# EasyEDA Pro project ProPrj_队内赛遥控器_2024-09-27.epro

# Schematic Schematic1
Board Name: Board1; Create Date: 2024-09-19
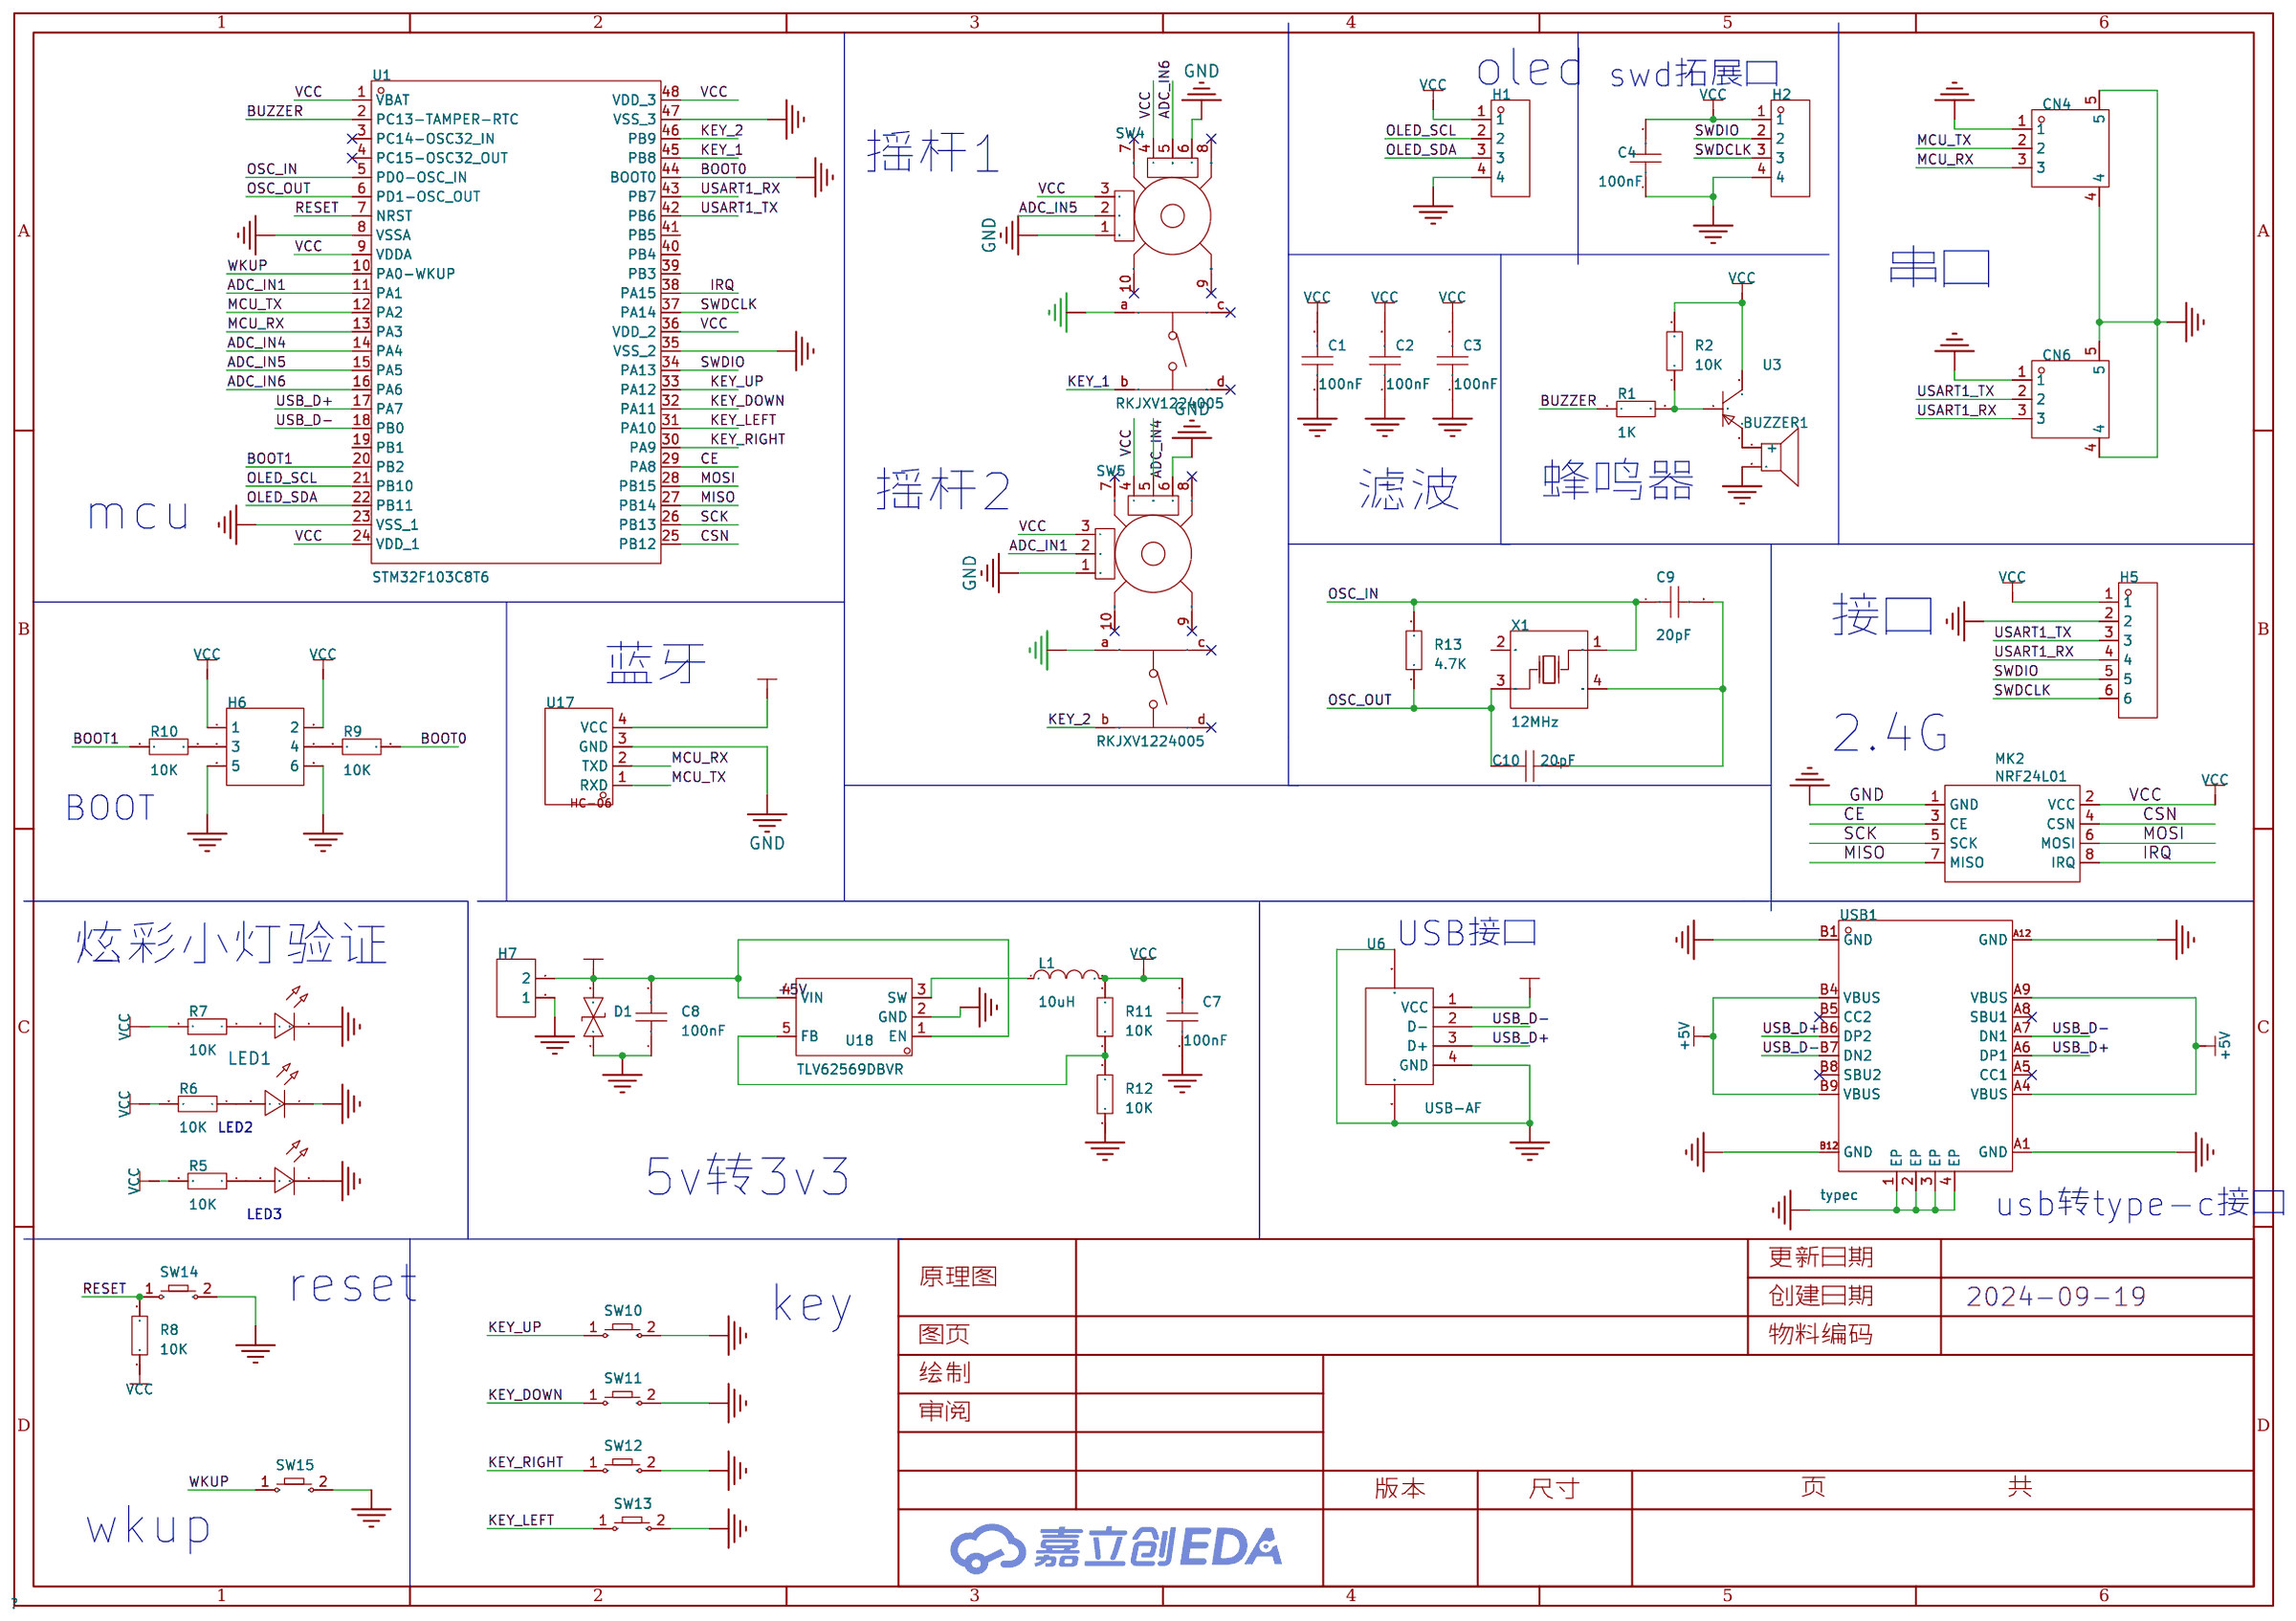
[diagram p0: schematic sheet]

## Parts
BUZZER1  buzzer-12X9  [BUZ-TH_BD12.0-P7.60-D0.6-FD]
C1  100nF  [C0603]
C2  100nF  [C0603]
C3  100nF  [C0603]
C4  100nF  [C0603]
C7  100nF  [C0603]
C8  100nF  [C0603]
C9  20pF  [C0603]
C10  20pF  [C0603]
CN4  A1257WV-S-3P  [CONN-SMD_A1257WV-S-3P]
CN6  A1257WV-S-3P  [CONN-SMD_A1257WV-S-3P]
D1  P6SMB6.8CA/TR13  [SMB_L4.6-W3.6-LS5.3-BI]
H1  -  [HDR-TH_4P-P2.54-V-F]
H2  -  [HDR-TH_4P-P2.54-V-F]
H5  -  [HDR-TH_6P-P2.54-V-F]
H6  -  [HDR-TH_6P-P2.54-V-F-R2-C3-S2.54]
H7  -  [HDR-TH_2P-P2.54-V-F]
L1  10uH  [L0603]
LED1  -  [LED_0603]
LED2  -  [LED_0603]
LED3  -  [LED_0603]
MK2  NRF24L01  [WIRELM-SMD_NRF24L01]
R1  1K  [R0603]
R2  10K  [R0603]
R5  10K  [R0603]
R6  10K  [R0603]
R7  10K  [R0603]
R8  10K  [R0603]
R9  10K  [R0603]
R10  10K  [R0603]
R11  10K  [R0603]
R12  10K  [R0603]
R13  4.7K  [R0603]
SW4  RKJXV1224005  [SW-TH_RKJXV1224005]
SW5  RKJXV1224005  [SW-TH_RKJXV1224005]
SW10  -  [Key_SMD_3x4x2]
SW11  -  [Key_SMD_3x4x2]
SW12  -  [Key_SMD_3x4x2]
SW13  -  [Key_SMD_3x4x2]
SW14  -  [Key_SMD_3x4x2]
SW15  -  [Key_SMD_3x4x2]
U1  STM32F103C8T6  [LQFP-48_L7.0-W7.0-P0.50-LS9.0-BL]
U3  S9012  [SOT-23-3_L2.9-W1.3-P0.95-LS2.4-BR]
U6  USB-AF  [USB-A-TH_USB-302-T]
U17  -  [HC-06]
U18  TLV62569DBVR  [SOT-23-5_L3.0-W1.7-P0.95-LS2.8-BR]
USB1  typec  [USB-C-SMD_KH-TYPE-C-16P]
X1  12MHz  [OSC-SMD_4P-L3.2-W2.5-BL]

## Library data of the parts
BUZZER1 = buzzer-12X9: Supplier Part: C9900016920; Supplier Footprint: BUZZER_SMT_9650B; JLCPCB Part Class: 扩展库; Supplier: LCSC
C1-C4 C7-C10 = CAP_0603: Supplier Footprint: 0603
CN4 CN6 = A1257WV-S-3P: 插针结构:1x3P;间距:1.25mm;安装方式:-;参考系列:GH;总PIN数:3P;排数:1;每排PIN数:3;行距:-;触头材质:黄铜;; LCSC Part Name: 系列:GH 间距:1.25mm 1x3P; Supplier Part: C225119; Manufacturer: CJT(长江连接器); Supplier Footprint: SMD,P=1.25mm; JLCPCB Part Class: 扩展库; Datasheet: https://atta.szlcsc.com/upload/public/pdf/source/20181008/C272994_C9E89FA8A36D0009CAD30AD8C59C2782.pdf; Supplier: LCSC; Pins Structure: 1x3P; Pitch: 1.25mm; Reference Series: GH; Number of Pins: 3P; Number of Rows: 1; Number of PINs Per Row: 3; Contact Material: 黄铜
D1 = P6SMB6.8CA/TR13: 反向截止电压(Vrwm):5.8V;最大钳位电压:10.5V;峰值脉冲电流(Ipp)@10/1000us:58.1A;峰值脉冲功率(Ppp)@10/1000us:600W;击穿电压:6.45V;; Supplier Part: C78395; Manufacturer: Brightking(君耀电子); Supplier Footprint: SMB(DO-214AA); JLCPCB Part Class: 基础库; Datasheet: https://atta.szlcsc.com/upload/public/pdf/source/20160709/1468031879762.pdf; Supplier: LCSC; Reverse Stand-Off Voltage (Vrwm): 5.8V; Maximum Clamping Voltage: 10.5V; Peak Pulse Current (Ipp)@10/1000us: 58.1A; Peak Pulse Power Dissipation (Ppp)@10/1000us: 600W; Breakdown Voltage: 6.45V; Type: TVS
H1 H2 = HDR-F_2.54_1x4P: Supplier Part: C2718488; Supplier Footprint: 插件
H5 = HDR-F_2.54_1x6P: Supplier Part: C40877; Supplier Footprint: 插件
H6 = HDR-F_2.54_2x3: Supplier Part: C92272; Supplier Footprint: 插件
H7 = HDR-F_2.54_1x2P: Supplier Part: C49661; Supplier Footprint: 插件
L1 = L_0603
LED1 = LED_0603-R: Supplier Footprint: 0603
LED2 = LED_0603-G: Supplier Footprint: 0603
LED3 = LED_0603-B: Supplier Footprint: 0603
MK2 = NRF24L01: Supplier: LCSC; Manufacturer: Ai-Thinker; Manufacturer Part: NRF24L01+功率加强版绑定2.4Gwireless module; Supplier Part: C90751
R1 R2 R5-R13 = Res_0603: Supplier Footprint: 0603
SW4 SW5 = RKJXV1224005: 操纵杆复位 中央按动开关 适用于航模玩具遥控器电位器、3D摇杆PS4手柄游戏机、无人机摇杆电位器、工业控制器; Supplier Part: C146170; Manufacturer: ALPSALPINE(阿尔卑斯阿尔派); Supplier Footprint: 13x13mm; JLCPCB Part Class: Extended Part; Datasheet: https://atta.szlcsc.com/upload/public/pdf/source/20180125/C146170_15168615510911301620.pdf; Supplier: LCSC
SW10-SW15 = Key_SMD_3x4x2: Supplier Footprint: SMD
U1 = STM32F103C8T6: CPU内核:ARM-M3;程序存储容量:64KB;RAM总容量:20KB;GPIO端口数量:37;工作电压范围:2V~3.6V;CPU最大主频:72MHz;程序存储器类型:FLASH;; LCSC Part Name: 主流增强型ARM Cortex-M3 MCU，具有64 KB Flash、72 MHz CPU、电机控制、USB和CAN; Supplier Part: C8734; Manufacturer: ST(意法半导体); Supplier Footprint: LQFP-48(7x7); JLCPCB Part Class: 扩展库; Datasheet: https://atta.szlcsc.com/upload/public/pdf/source/20220812/8363ACEC51AD55ECEB84799464F7CB85.pdf; Supplier: LCSC; CPU Core: ARM-M3; Program Storage Size: 64KB; RAM Size: 20KB; GPIO Ports Number: 37; Operating Voltage Range: 2V~3.6V; CPU Maximum Speed: 72MHz; Program Memory Type: FLASH; Operating Temperature Range: -40℃~+85℃; ADC (Bit): 12bit; Universal Serial Bus: 有; Peripheral/Function: 看门狗；DMA；看门狗；温度传感器; Watchdog: 有; Infrared Data Association: 有; Low-Voltage Detect: 有; Direct Memory Access: 有; Internal Oscillator: 有
U3 = S9012_C2914401: LCSC Part Name: 三极管; Supplier Part: C2914401; Manufacturer: MSKSEMI(美森科); Supplier Footprint: SOT-23; Datasheet: https://atta.szlcsc.com/upload/public/pdf/source/20231208/E0AD297AB2D8DB55F2C7FE99169BA696.pdf; Supplier: LCSC
U6 = USB-AF: Supplier Part: C9900021158; Supplier Footprint: USB-A; JLCPCB Part Class: 扩展库; Supplier: LCSC
U17 = HC-06: 蓝牙模块-4P; _: 3; Check: false
U18 = TLV62569DBVR: 功能类型:降压型;输出类型:可调;输入电压:2.5V~5.5V;输出电压:600mV~5.5V;输出电流(最大值):2A;; Supplier Part: C141836; Manufacturer: TI(德州仪器); Supplier Footprint: SOT-23-5; JLCPCB Part Class: 扩展库; Datasheet: https://www.ti.com/cn/lit/gpn/tlv62569; Supplier: LCSC; Function: 降压型; Output Type: 可调; Input Voltage: 2.5V~5.5V; Output Voltage: 600mV~5.5V; Output Current (Max): 2A; Switching Frequency: 1.5MHz; Operating Temperature: -40℃~+125℃@(TJ); Synchronous Rectification: 是; Topology: 降压式; Switch tube (built-in/external): 内置
USB1 = typec: Supplier Part: C9900016956; Supplier Footprint: typec 12p; JLCPCB Part Class: 扩展库; Supplier: LCSC
X1 = X322512MSB4SI: 晶振类型:贴片晶振;频率:12MHz;常温频差:±10ppm;外接负载电容:20pF;频率稳定度(全温):±20ppm;; LCSC Part Name: 12MHz ±10ppm 20pF; Supplier Part: C9002; Manufacturer: YXC(扬兴晶振); Supplier Footprint: SMD3225-4P; JLCPCB Part Class: 基础库; Datasheet: https://atta.szlcsc.com/upload/public/pdf/source/20240329/19D5F850207469550BEB00D7DFEDBC7A.pdf; Supplier: LCSC; Crystal Type: 贴片晶振; Normal temperature Frequency Tolerance: ±10ppm; External load capacitor: 20pF; Frequency Stability(Full temperature range): ±20ppm; Operating Temperature: -40℃~+85℃

## Nets
+5V: C8.2 D1.2 H7.2 U6.1(VCC) U18.1(EN) U18.4(VIN) USB1.A4(VBUS) USB1.A9(VBUS) USB1.B4(VBUS) USB1.B9(VBUS)
GND: BUZZER1.2 C1.1 C2.1 C3.1 C4.1 C7.1 C8.1 CN4.1 CN4.4 CN4.5 CN6.1 CN6.4 CN6.5 D1.1 H1.4 H2.4 H5.2 H6.5 H6.6 H7.1 LED1.1(C) LED2.1(C) LED3.1(C) MK2.1(GND) R12.1 SW4.1(B) SW4.6(B) SW4.a SW5.1(B) SW5.6(B) SW5.a SW10.2 SW11.2 SW12.2 SW13.2 SW14.2 SW15.2 U1.8(VSSA) U1.23(VSS_1) U1.35(VSS_2) U1.47(VSS_3) U6.4(GND) U6.5 U6.6 U17.3(GND) U18.2(GND) USB1.1(EP) USB1.2(EP) USB1.3(EP) USB1.4(EP) USB1.A1(GND) USB1.A12(GND) USB1.B1(GND) USB1.B12(GND)
VCC: C1.2 C2.2 C3.2 C4.2 C7.2 H1.1 H2.1 H5.1 H6.1 H6.2 L1.2 MK2.2(VCC) R2.2 R5.2 R6.2 R7.2 R8.1 R11.2 SW4.3(A) SW4.4(A) SW5.3(A) SW5.4(A) U1.1(VBAT) U1.9(VDDA) U1.24(VDD_1) U1.36(VDD_2) U1.48(VDD_3) U3.3(C) U17.4(VCC)
ADC_IN1: SW5.2(DTA) U1.11(PA1)
ADC_IN4: SW5.5(DTA) U1.14(PA4)
ADC_IN5: SW4.2(DTA) U1.15(PA5)
ADC_IN6: SW4.5(DTA) U1.16(PA6)
BOOT0: R9.2 U1.44(BOOT0)
BOOT1: R10.1 U1.20(PB2)
BUZZER: R1.1 U1.2(PC13-TAMPER-RTC)
CE: MK2.3(CE) U1.29(PA8)
CSN: MK2.4(CSN) U1.25(PB12)
IRQ: MK2.8(IRQ) U1.38(PA15)
KEY_1: SW4.b U1.45(PB8)
KEY_2: SW5.b U1.46(PB9)
KEY_DOWN: SW11.1 U1.32(PA11)
KEY_LEFT: SW13.1 U1.31(PA10)
KEY_RIGHT: SW12.1 U1.30(PA9)
KEY_UP: SW10.1 U1.33(PA12)
MCU_RX: CN4.3 U1.13(PA3) U17.2(TXD)
MCU_TX: CN4.2 U1.12(PA2) U17.1(RXD)
MISO: MK2.7(MISO) U1.27(PB14)
MOSI: MK2.6(MOSI) U1.28(PB15)
OLED_SCL: H1.2 U1.21(PB10)
OLED_SDA: H1.3 U1.22(PB11)
OSC_IN: C9.1 R13.2 U1.5(PD0-OSC_IN) X1.1(OSC1)
OSC_OUT: C10.1 R13.1 U1.6(PD1-OSC_OUT) X1.3(OSC2)
RESET: R8.2 SW14.1 U1.7(NRST)
SCK: MK2.5(SCK) U1.26(PB13)
SWDCLK: H2.3 H5.6 U1.37(PA14)
SWDIO: H2.2 H5.5 U1.34(PA13)
USART1_RX: CN6.3 H5.4 U1.43(PB7)
USART1_TX: CN6.2 H5.3 U1.42(PB6)
USB_D+: U1.17(PA7) U6.3(D+) USB1.A6(DP1) USB1.B6(DP2)
USB_D-: U1.18(PB0) U6.2(D-) USB1.A7(DN1) USB1.B7(DN2)
WKUP: SW15.1 U1.10(PA0-WKUP)
$1N1068: BUZZER1.1(+) U3.2(E)
$1N1070: R1.2 R2.1 U3.1(B)
$1N1843: LED3.2(A) R5.1
$1N1848: LED2.2(A) R6.1
$1N1853: LED1.2(A) R7.1
$1N7181: H6.4 R9.1
$1N7183: H6.3 R10.2
$1N9291: R11.1 R12.2 U18.5(FB)
$1N9393: L1.1 U18.3(SW)
$1N10654: C9.2 C10.2 X1.4(GND)

Not connected (* = marked no-connect by the designer): SW4 7(GND)* 8(GND)* 9(GND)* 10(GND)* c* d*; SW5 7(GND)* 8(GND)* 9(GND)* 10(GND)* c* d*; U1 3(PC14-OSC32_IN)* 4(PC15-OSC32_OUT)* 19(PB1) 39(PB3) 40(PB4) 41(PB5); USB1 A5(CC1)* A8(SBU1)* B5(CC2)* B8(SBU2)*; X1 2(GND)

## Notes on the sheet
- oled
- swd拓展口
- 摇杆1
- 串口
- 摇杆2
- 滤波
- 蜂鸣器
- mcu
- 接口
- 蓝牙
- 2.4G
- BOOT
- USB接口
- 炫彩小灯验证
- 5v转3v3
- usb转type-c接口
- reset
- key
- wkup

# Board PCB6
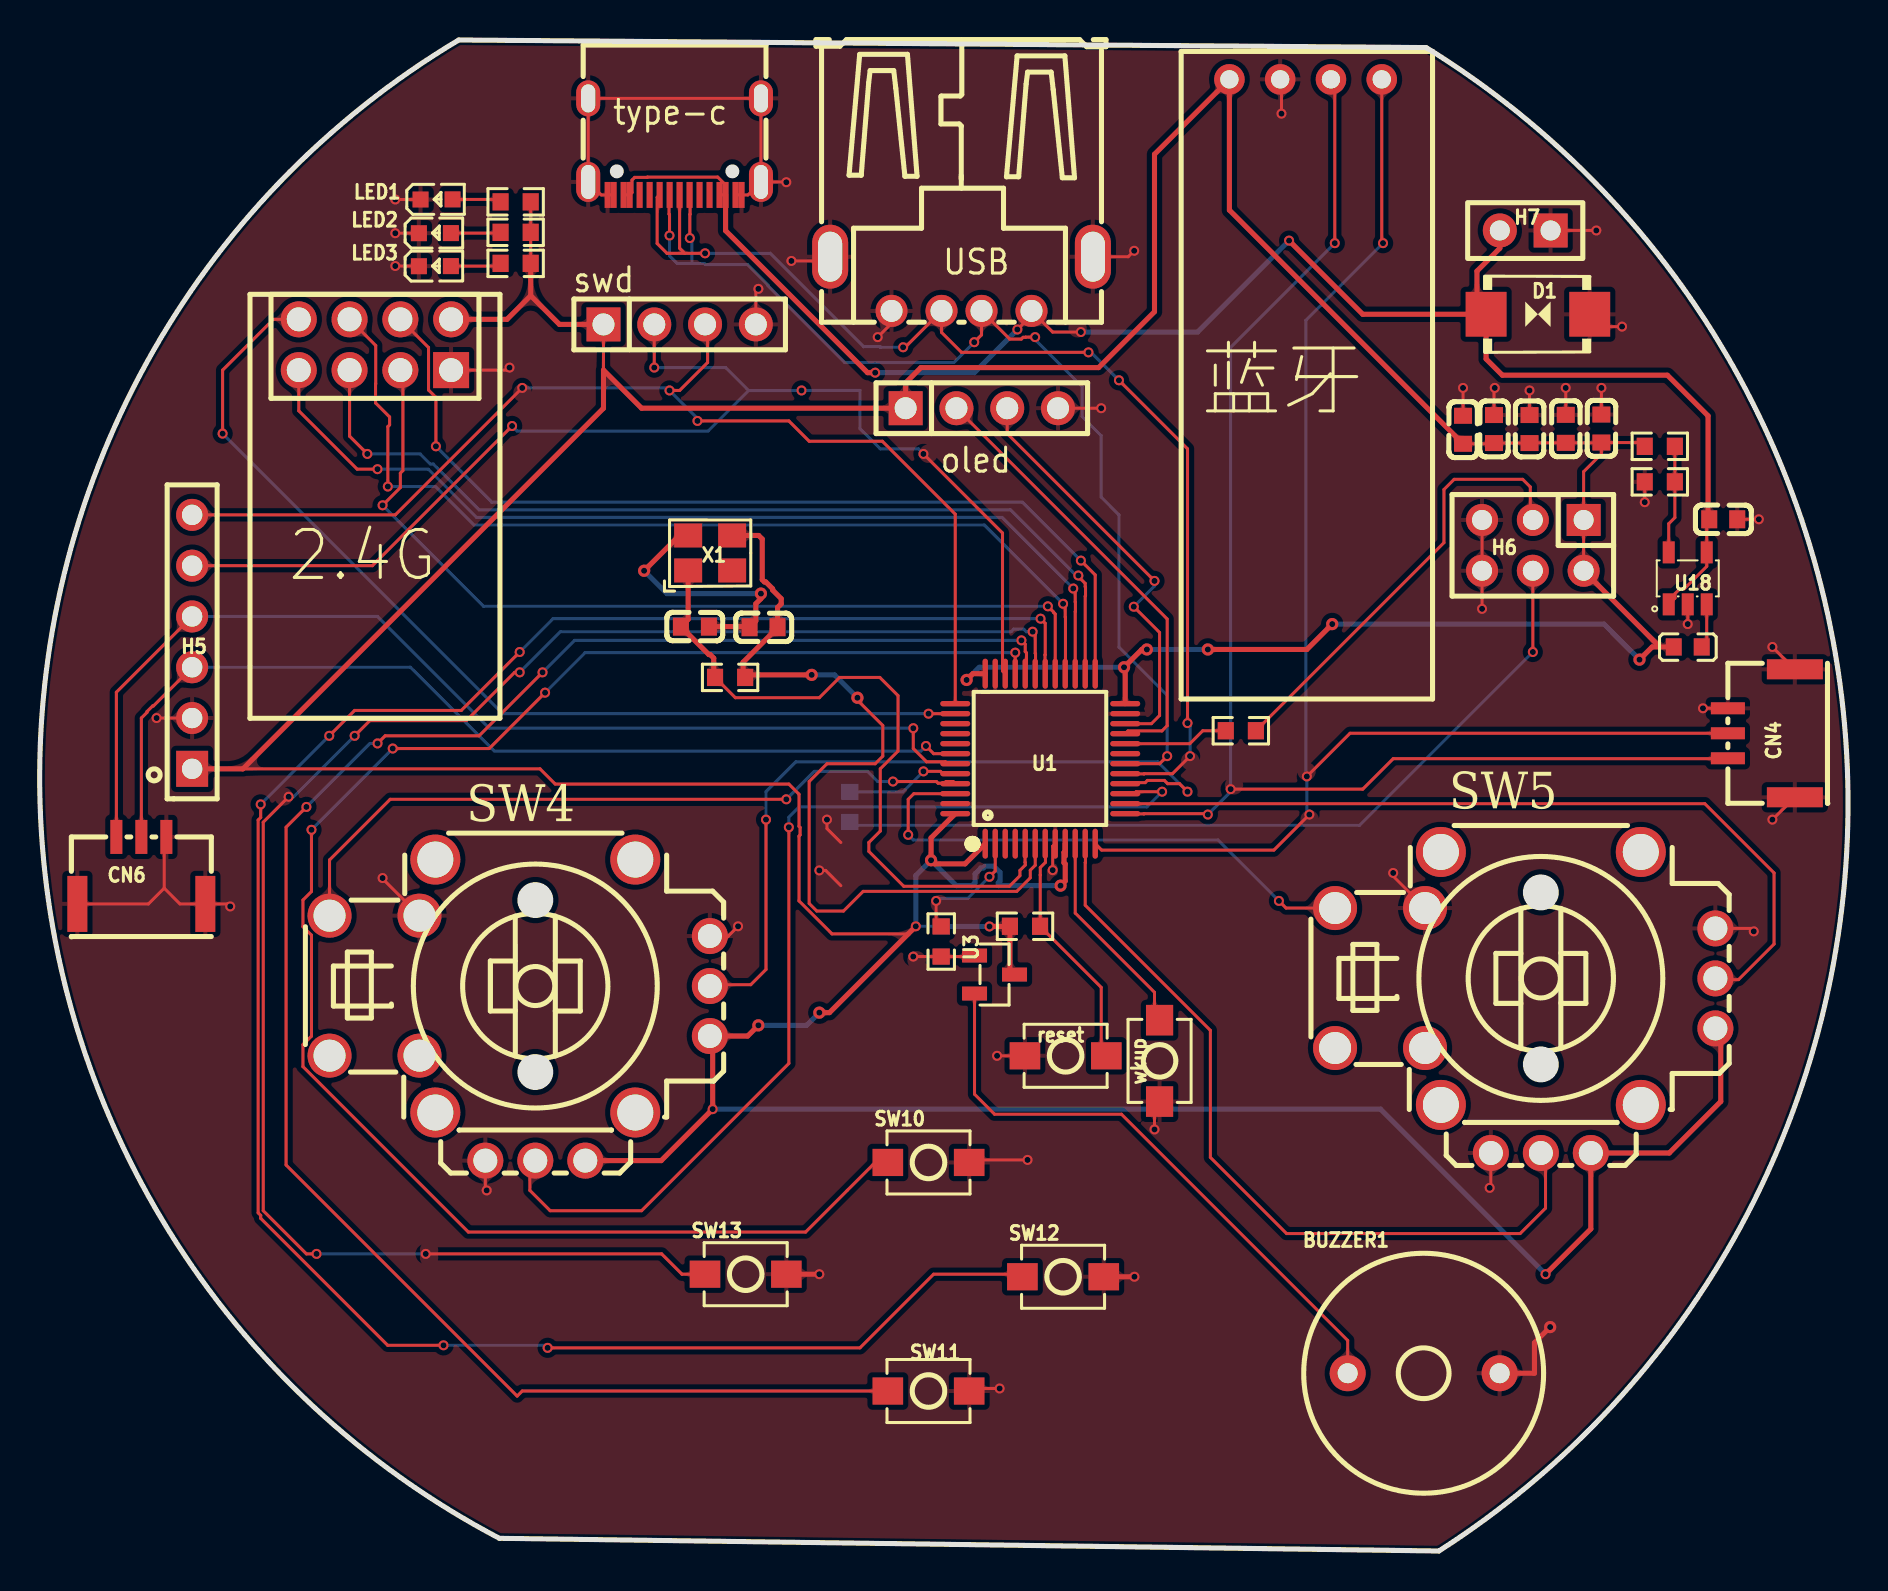
[diagram p1: board, top side]
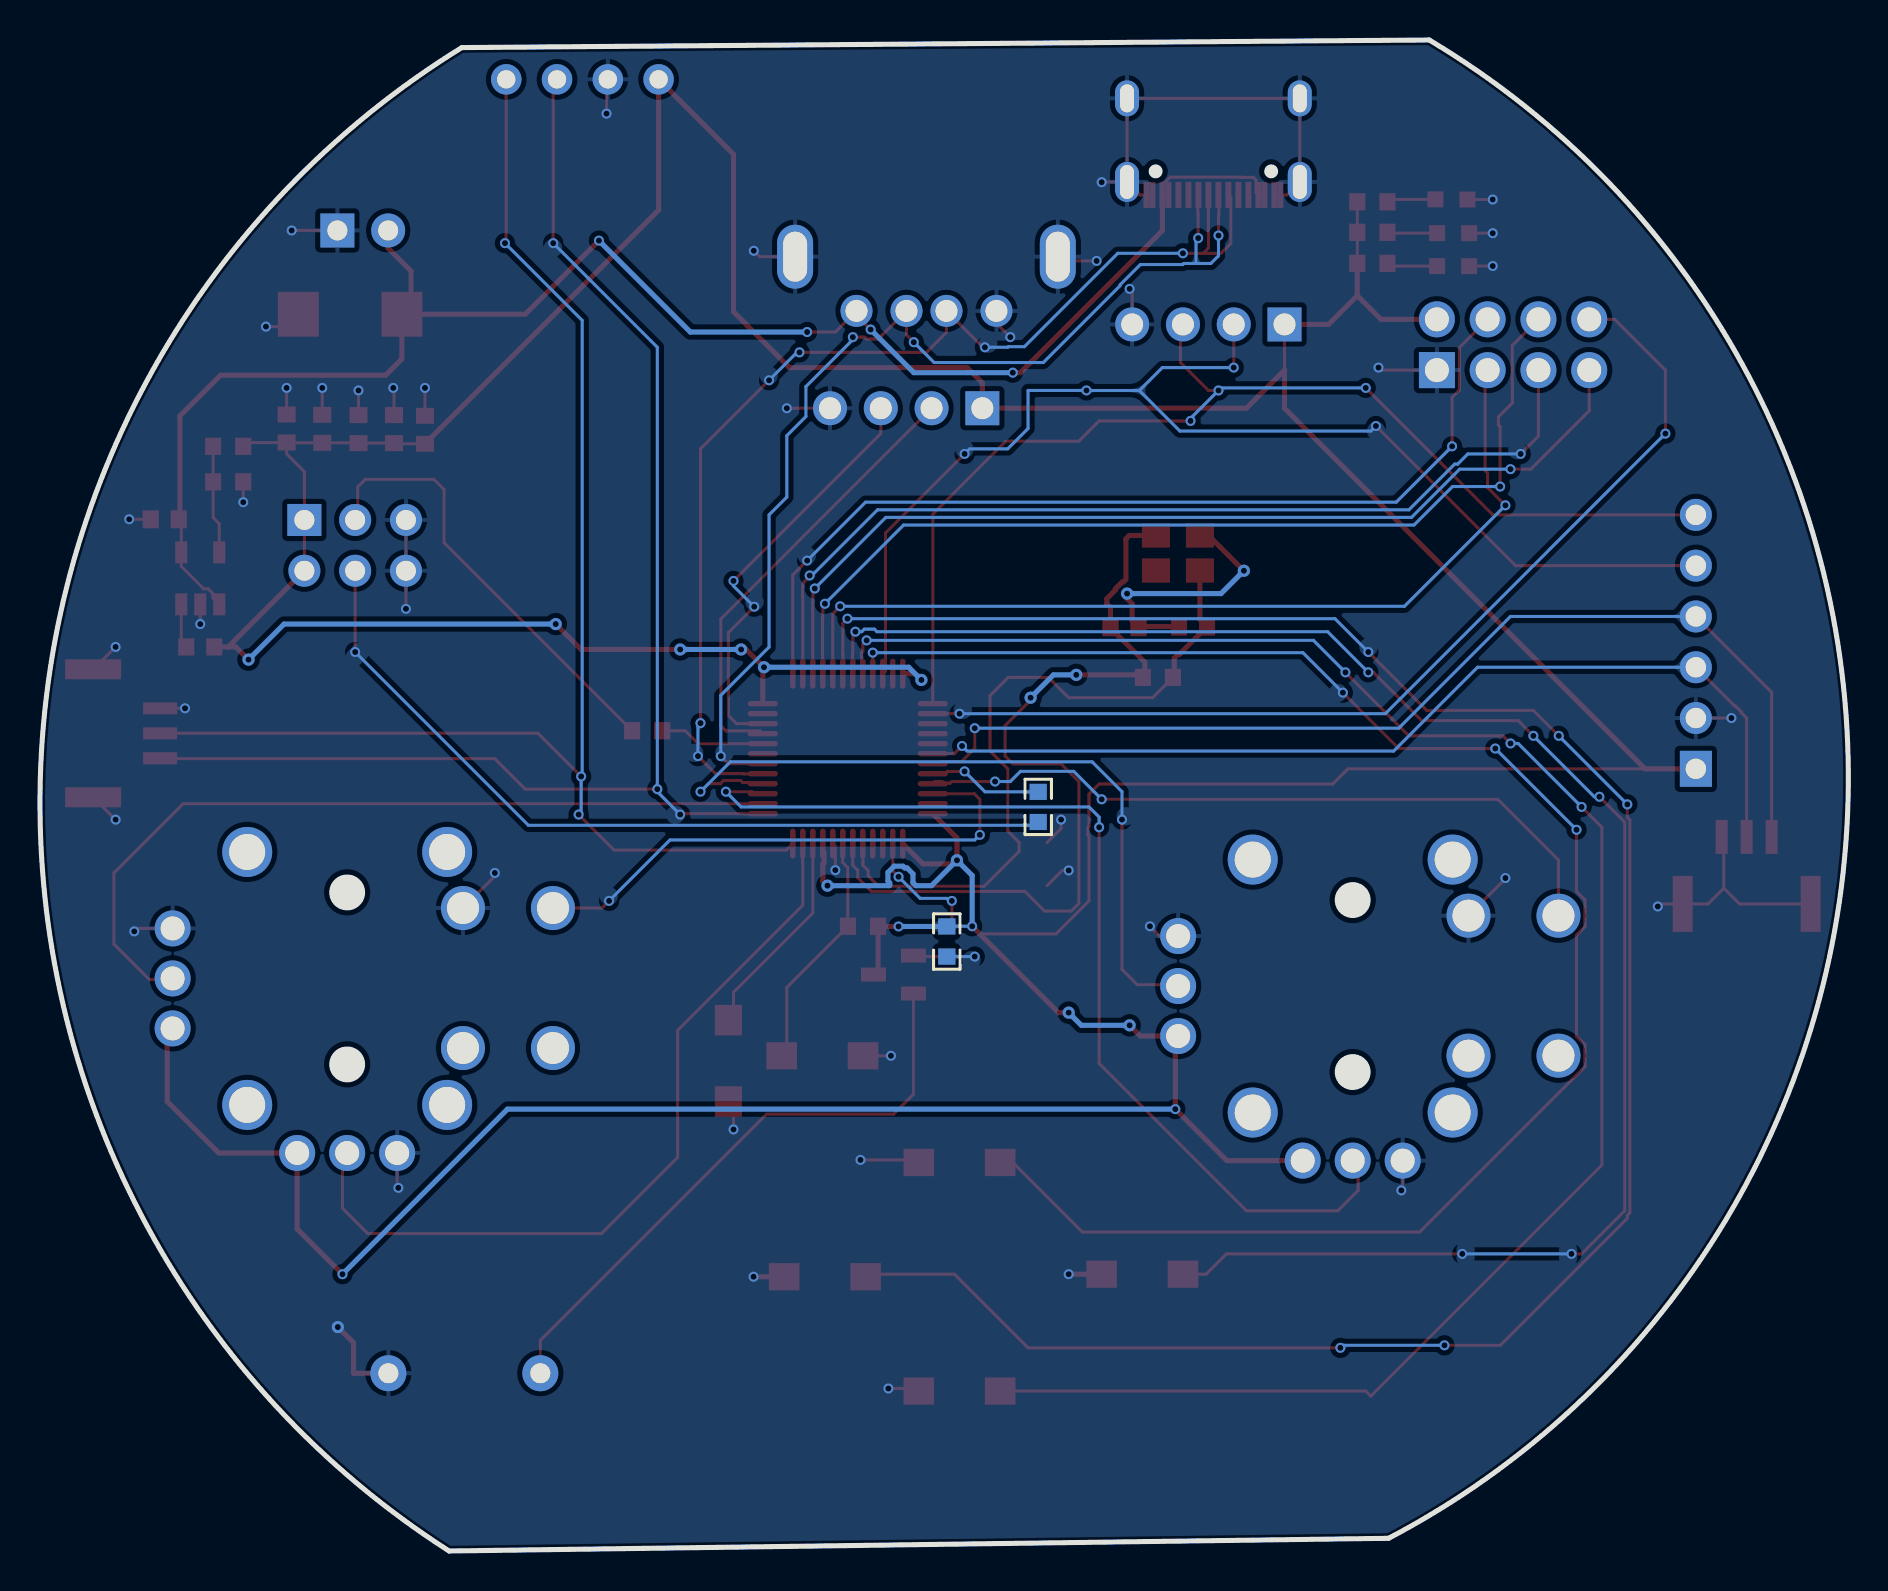
[diagram p2: board, bottom side, seen from below]

Outline 90.43 x 75.57 mm; copper layers: Top Layer, Bottom Layer. Coordinates in mm from the lower left corner of the outline.
Outline path: 20.94,75.57 69.33,75.18 arc(90.43,37.77) 69.97,0 22.98,0.64 arc(0,37.5) 20.94,75.57
Stack: Top Layer 0.035mm / Dielectric1 1.51mm FR4 er 4.5 / Bottom Layer 0.035mm

## Design rules (mm)
template: JLCPCB Capability(Two Layers Board)
spacing copperThickness1oz (default): track to track 0.102, other pairs 0.152 to 0.3
spacing copperThickness2oz: track to track 0.203, other pairs 0.152 to 0.3
track width copperThickness1oz (default): min 0.127, default 0.254, max 2.54
track width copperThickness2oz: min 0.203, default 0.254, max 2.54
differential pair differentialPair (default): width min 0.127, default 0.254, max 2.54; gap min 0.152, default 0.152
via viaSize (default): diameter min 0.5, default 0.61, max 10; hole min 0.3, default 0.305, max 6.3

## Placement (name value [footprint] x y rotation side)
2.4G  NRF24L01  [WIRELM-SMD_NRF24L01]  16.75 60.33 0 top
BUZZER1  buzzer-12X9  [BUZ-TH_BD12.0-P7.60-D0.6-FD]  69.2 8.89 0 top
C1  100nF  [C0603]  76.31 56.12 270 top
C2  100nF  [C0603]  74.5 56.11 270 top
C3  100nF  [C0603]  72.72 56.11 270 top
C4  100nF  [C0603]  71.17 56.07 270 top
C7  100nF  [C0603]  78.09 56.13 270 top
C8  100nF  [C0603]  84.19 51.6 180 top
C9  20pF  [C0603]  32.76 46.23 0 top
C10  20pF  [C0603]  36.19 46.2 180 top
CN4  A1257WV-S-3P  [CONN-SMD_A1257WV-S-3P]  86.1 40.89 90 top
CN6  A1257WV-S-3P  [CONN-SMD_A1257WV-S-3P]  5.07 34.04 0 top
D1  P6SMB6.8CA/TR13  [SMB_L4.6-W3.6-LS5.3-BI]  74.92 61.85 180 top
H5  串口接口  [HDR-TH_6P-P2.54-V-F]  7.61 45.47 90 top
H6  -  [HDR-TH_6P-P2.54-V-F-R2-C3-S2.54]  74.67 50.29 180 top
H7  -  [HDR-TH_2P-P2.54-V-F]  74.28 66.04 180 top
L1  10uH  [L0603]  82.41 45.21 180 top
LED1  -  [LED_0603]  19.89 67.6 0 top
LED2  -  [LED_0603]  19.8 65.91 0 top
LED3  -  [LED_0603]  19.8 64.26 0 top
oled  -  [HDR-TH_4P-P2.54-V-F]  47.11 57.15 0 top
R1  1K  [R0603]  45.07 30.48 270 top
R2  10K  [R0603]  45.07 30.48 90 bottom
R5  10K  [R0603]  23.79 64.39 0 top
R6  10K  [R0603]  23.79 65.95 0 top
R7  10K  [R0603]  23.79 67.47 0 top
R8  10K  [R0603]  49.27 31.24 0 top
R9  10K  [R0603]  40.5 37.21 90 bottom
R10  10K  [R0603]  60.06 41.02 0 top
R11  10K  [R0603]  81.02 55.25 180 top
R12  10K  [R0603]  81.02 53.47 0 top
R13  4.7K  [R0603]  34.52 43.69 180 top
reset  -  [Key_SMD_3x4x2]  51.3 24.77 180 top
SW4  RKJXV1224005  [SW-TH_RKJXV1224005]  23.99 27.05 270 top
SW5  RKJXV1224005  [SW-TH_RKJXV1224005]  74.28 27.43 270 top
SW10  -  [Key_SMD_3x4x2]  44.44 19.43 0 top
SW11  -  [Key_SMD_3x4x2]  44.44 8 0 top
SW12  -  [Key_SMD_3x4x2]  51.17 13.72 0 top
SW13  -  [Key_SMD_3x4x2]  35.3 13.84 0 top
swd  -  [HDR-TH_4P-P2.54-V-F]  31.99 61.34 0 top
type-c  typec  [USB-C-SMD_KH-TYPE-C-16P]  31.74 70.23 180 top
U1  STM32F103C8T6  [LQFP-48_L7.0-W7.0-P0.50-LS9.0-BL]  50.03 39.62 0 top
U3  S9012  [SOT-23-3_L2.9-W1.3-P0.95-LS2.4-BR]  47.74 28.83 180 top
U18  TLV62569DBVR  [SOT-23-5_L3.0-W1.7-P0.95-LS2.8-BR]  82.41 48.64 270 top
USB  USB-AF  [USB-A-TH_USB-302-T]  46.09 63.37 180 top
wkup  -  [Key_SMD_3x4x2]  56 24.51 270 top
X1  12MHz  [OSC-SMD_4P-L3.2-W2.5-BL]  33.52 49.91 0 top
蓝牙  -  [HC-06]  63.36 58.8 0 top

## Footprints (pads in the part's own frame, mm; a bottom-side part is the same pattern mirrored in y, then rotated)
BUZ-TH_BD12.0-P7.60-D0.6-FD
  round 1.8 hole 1: 1(-3.8,0) 2(3.8,0)
C0603
  rect 0.8x0.9 smd: 1(-0.7,0) 2(0.7,0)
CONN-SMD_A1257WV-S-3P
  rect 0.6x1.7 smd: 1(1.25,1.675) 2(0,1.675) 3(-1.25,1.675)
  rect 1x2.8 smd: 4(3.2,-1.675) 5(-3.2,-1.675)
HC-06
  round 1.524 hole 0.914: 1(3.747,14.796) 2(1.206,14.796) 3(-1.333,14.796) 4(-3.873,14.796)
HDR-TH_2P-P2.54-V-F
  rect 1.7x1.7 hole 1: 1(-1.27,0)
  round 1.7 hole 1: 2(1.27,0)
HDR-TH_4P-P2.54-V-F
  rect 1.7x1.7 hole 1.1: 1(-3.81,0)
  round 1.7 hole 1.1: 2(-1.27,0) 3(1.27,0) 4(3.81,0)
HDR-TH_6P-P2.54-V-F
  rect 1.8x1.6 hole 1.02: 1(-6.35,0)
  round 1.6 hole 1.02: 2(-3.81,0) 3(-1.27,0) 4(1.27,0) 5(3.81,0) 6(6.35,0)
HDR-TH_6P-P2.54-V-F-R2-C3-S2.54
  rect 1.7x1.6 hole 1: 1(-2.54,-1.27)
  round 1.6 hole 1: 2(-2.54,1.27) 3(0,-1.27) 4(0,1.27) 5(2.54,-1.27) 6(2.54,1.27)
Key_SMD_3x4x2
  rect 1.53x1.36 smd: 1(-2.035,0) 2(2.035,0)
L0603
  rect 0.8x0.864 smd: 1(-0.7,0) 2(0.7,0)
LED_0603
  rect 0.8x0.8 smd: 1(-0.851,-0.01) 2(0.75,-0.005)
LQFP-48_L7.0-W7.0-P0.50-LS9.0-BL
  oval 0.27x1.5 smd: 1(-2.75,-4.25) 2(-2.25,-4.25) 3(-1.75,-4.25) 4(-1.25,-4.25) 5(-0.75,-4.25) 6(-0.25,-4.25) 7(0.25,-4.25) 8(0.75,-4.25) 9(1.25,-4.25) 10(1.75,-4.25) 11(2.25,-4.25) 12(2.75,-4.25) 25(2.75,4.25) 26(2.25,4.25) 27(1.75,4.25) 28(1.25,4.25) 29(0.75,4.25) 30(0.25,4.25) 31(-0.25,4.25) 32(-0.75,4.25) 33(-1.25,4.25) 34(-1.75,4.25) 35(-2.25,4.25) 36(-2.75,4.25)
  oval 1.5x0.27 smd: 13(4.25,-2.75) 14(4.25,-2.25) 15(4.25,-1.75) 16(4.25,-1.25) 17(4.25,-0.75) 18(4.25,-0.25) 19(4.25,0.25) 20(4.25,0.75) 21(4.25,1.25) 22(4.25,1.75) 23(4.25,2.25) 24(4.25,2.75) 37(-4.25,2.75) 38(-4.25,2.25) 39(-4.25,1.75) 40(-4.25,1.25) 41(-4.25,0.75) 42(-4.25,0.25) 43(-4.25,-0.25) 44(-4.25,-0.75) 45(-4.25,-1.25) 46(-4.25,-1.75) 47(-4.25,-2.25) 48(-4.25,-2.75)
OSC-SMD_4P-L3.2-W2.5-BL
  rect 1.4x1.2 smd: 1(-1.1,-0.875) 2(1.1,-0.875) 3(1.1,0.875) 4(-1.1,0.875)
R0603
  rect 0.806x0.864 smd: 1(-0.753,0) 2(0.753,0)
SMB_L4.6-W3.6-LS5.3-BI
  rect 2.047x2.241 smd: 1(-2.591,0) 2(2.591,0)
SOT-23-3_L2.9-W1.3-P0.95-LS2.4-BR
  rect 1.25x0.7 smd: 1(1,-0.95) 2(1,0.95) 3(-1,0)
SOT-23-5_L3.0-W1.7-P0.95-LS2.8-BR
  rect 1.1x0.6 smd: 1(1.3,-0.95) 2(1.3,0) 3(1.3,0.95) 4(-1.3,0.95) 5(-1.3,-0.95)
SW-TH_RKJXV1224005
  round 1.8 hole 1.2: 1(7.527,-1.719) 2(7.527,0.781) 3(7.527,3.281) 4(1.298,9.511) 5(-1.202,9.511) 6(-3.703,9.511)
  round 2.5 hole 1.8: 7(-7.527,5.781) 8(-7.527,-4.219) 9(5.122,-4.219) 10(5.122,5.781)
  round 2.2 hole 1.6: a(-4.721,-5.011) b(-4.721,-9.511) c(2.279,-5.011) d(2.279,-9.511)
USB-A-TH_USB-302-T
  round 1.6 hole 1.1: 1(-3.5,1.355) 2(-1,1.355) 3(1,1.355) 4(3.5,1.355)
  oval 1.8x3.2 hole 1.2x2.5: 5(-6.57,-1.355) 6(6.57,-1.355)
USB-C-SMD_KH-TYPE-C-16P
  oval 1.2x2 hole 0.7x1.7: 1(-4.32,1.765) 2(4.32,1.765)
  oval 1.2x1.8 hole 0.7x1.4: 3(-4.32,-2.415) 4(4.32,-2.415)
  rect 0.3x1.3 smd: A1(-3.35,2.415) A4(-2.55,2.415) A5(-1.25,2.415) A6(-0.25,2.415) A7(0.25,2.415) A8(1.25,2.415) A9(2.55,2.415) A12(3.35,2.415) B1(3.05,2.415) B4(2.25,2.415) B5(1.75,2.415) B6(0.75,2.415) B7(-0.75,2.415) B8(-1.75,2.415) B9(-2.25,2.415) B12(-3.05,2.415)
WIRELM-SMD_NRF24L01
  rect 1.8x1.8 hole 1.2: 1(3.808,-1.27)
  round 1.8 hole 1.2: 2(3.81,1.27) 3(1.27,-1.27) 4(1.27,1.27) 5(-1.27,-1.27) 6(-1.27,1.27) 7(-3.81,-1.27) 8(-3.81,1.27)

## Nets
+5V: C8.2 D1.2 H7.2 type-c.A4 type-c.A9 type-c.B4 type-c.B9 U18.1 U18.4 USB.1
GND: 2.4G.1 BUZZER1.2 C1.1 C2.1 C3.1 C4.1 C7.1 C8.1 CN4.1 CN4.4 CN4.5 CN6.1 CN6.4 CN6.5 D1.1 H5.2 H6.5 H6.6 H7.1 LED1.1 LED2.1 LED3.1 oled.4 R12.1 reset.2 SW4.1 SW4.6 SW4.a SW5.1 SW5.6 SW5.a SW10.2 SW11.2 SW12.2 SW13.2 swd.4 type-c.1 type-c.2 type-c.3 type-c.4 type-c.A1 type-c.A12 type-c.B1 type-c.B12 U1.8 U1.23 U1.35 U1.47 U18.2 USB.4 USB.5 USB.6 wkup.2 蓝牙.3
VCC: 2.4G.2 C1.2 C2.2 C3.2 C4.2 C7.2 H5.1 H6.1 H6.2 L1.2 oled.1 R2.2 R5.2 R6.2 R7.2 R8.1 R11.2 SW4.3 SW4.4 SW5.3 SW5.4 swd.1 U1.1 U1.9 U1.24 U1.36 U1.48 U3.3 蓝牙.4
ADC_IN1: SW5.2 U1.11
ADC_IN4: SW5.5 U1.14
ADC_IN5: SW4.2 U1.15
ADC_IN6: SW4.5 U1.16
BOOT0: R9.2 U1.44
BOOT1: R10.1 U1.20
BUZZER: R1.1 U1.2
CE: 2.4G.3 U1.29
CSN: 2.4G.4 U1.25
IRQ: 2.4G.8 U1.38
KEY_1: SW4.b U1.45
KEY_2: SW5.b U1.46
KEY_DOWN: SW11.1 U1.32
KEY_LEFT: SW13.1 U1.31
KEY_RIGHT: SW12.1 U1.30
KEY_UP: SW10.1 U1.33
MCU_RX: CN4.3 U1.13 蓝牙.2
MCU_TX: CN4.2 U1.12 蓝牙.1
MISO: 2.4G.7 U1.27
MOSI: 2.4G.6 U1.28
OLED_SCL: oled.2 U1.21
OLED_SDA: oled.3 U1.22
OSC_IN: C9.1 R13.2 U1.5 X1.1
OSC_OUT: C10.1 R13.1 U1.6 X1.3
RESET: R8.2 reset.1 U1.7
SCK: 2.4G.5 U1.26
SWDCLK: H5.6 swd.3 U1.37
SWDIO: H5.5 swd.2 U1.34
USART1_RX: CN6.3 H5.4 U1.43
USART1_TX: CN6.2 H5.3 U1.42
USB_D+: type-c.A6 type-c.B6 U1.17 USB.3
USB_D-: type-c.A7 type-c.B7 U1.18 USB.2
WKUP: U1.10 wkup.1
$1N1068: BUZZER1.1 U3.2
$1N1070: R1.2 R2.1 U3.1
$1N1843: LED3.2 R5.1
$1N1848: LED2.2 R6.1
$1N1853: LED1.2 R7.1
$1N7181: H6.4 R9.1
$1N7183: H6.3 R10.2
$1N9291: R11.1 R12.2 U18.5
$1N9393: L1.1 U18.3
$1N10654: C9.2 C10.2 X1.4

Pads without a net: SW4 7 8 9 10 c d; SW5 7 8 9 10 c d; type-c A5 A8 B5 B8; U1 3 4 19 39 40 41; X1 2

## Via types
v1: diameter 0.5, hole 0.305, Top Layer to Bottom Layer, 123 vias
v2: diameter 0.61, hole 0.305, Top Layer to Bottom Layer, 15 vias

## Routing (per net, layer and track width the routed paths; a pad name or vN(x,y) marks a point on that pad's centre or on a via; arc(x,y) is an arc through that point)
+5V: length 84.6
  Top Layer w0.15: C8.2 83.36,51.47 83.36,49.24 82.24,48.12 82.02,48.12 81.78,47.88 81.78,47.66 U18.1
  Top Layer w0.152: type-c.B9 type-c.A4 34.29,68.32 33.9,68.71 30.38,68.71 30.37,68.69 29.75,68.69 29.61,68.56 29.61,67.94 type-c.B4 type-c.A9 ; v1(48.88,61.09) 49.59,61.79 USB.1 50.65,60.96 v1(52.06,60.96)
  Top Layer w0.254: H7.2 73.01,65.15 71.87,64.01 71.87,62.31 D1.2 ; v1(41.77,58.93) 41.39,58.93 34.29,66.03 type-c.A4 ; D1.2 72.33,59.61 73.14,58.8 81.4,58.8 83.43,56.77 83.43,51.66 C8.2 ; D1.2 66.16,61.85 v1(62.47,65.53)
  Bottom Layer w0.254: v1(48.88,61.09) 46.73,58.93 v1(41.77,58.93) ; v1(62.47,65.53) 57.9,60.96 v1(52.06,60.96)
GND: length 107.1
  Top Layer w0.15: C8.1 v1(85.97,51.6) ; LED3.1 18.94,64.26 v1(17.77,64.26) ; SW5.a 67.68,33.75 v1(67.68,33.91) ; C7.1 v1(78.09,58.17) ; v1(50.65,34.05) 50.65,35.25 U1.8 ; v1(35.93,63.12) 35.8,62.99 swd.4 ; v1(38.98,34.04) 39.29,34.04 40.06,33.27 ; v1(37.33,68.45) 37.31,68.47 type-c.1 ; SW5.1 72.57,18.22 v1(72.51,18.16) ; R12.1 v1(80.26,52.45) ; D1.1 78.13,61.23 v1(79.13,61.23) ; USB.5 54.43,64.73 v1(54.73,65.02) ; 蓝牙.3 62.09,73.53 v1(62.09,71.88) ; C3.1 72.72,58.13 v1(72.76,58.17) ; v1(37.58,64.52) 39.31,64.52 USB.6 ; v1(72.13,47.12) H6.6 H6.5 ; H7.1 v1(77.84,66.04) ; LED1.1 v1(17.77,67.59) ; USB.4 42.59,61.4 v1(41.9,60.71) ; type-c.1 type-c.3 type-c.4 type-c.2 28.07,67.82 type-c.A12 type-c.B1 ; type-c.1 35.41,67.82 type-c.A1 type-c.B12 ; v1(85.71,30.99) 85.57,31.13 SW5.6 ; v1(47.87,24.77) 48.88,24.77 49.01,24.64 ; v1(39.36,36.58) 39.36,36.13 40.06,35.43 ; C2.1 v1(74.5,58.04) ; U18.2 v1(82.41,46.36) ; oled.4 v1(53.08,57.15) ; C1.1 v1(76.31,58.17) ; H5.2 v1(5.83,41.66) ; C4.1 v1(71.17,58.17) ; 55.74,22.48 v1(55.74,21.08) ; LED2.1 v1(17.77,65.9)
  Top Layer w0.152: CN4.5 86.65,36.58 v1(86.65,36.58) ; 6.21,33.15 7,32.36 CN6.4 9.39,32.36 v1(9.51,32.23) ; 6.21,33.15 5.43,32.36 CN6.5 ; 6.21,33.15 6.21,35.6 CN6.1 ; 34.43,30.75 34.17,30.5 33.25,30.5 ; 34.43,30.75 v1(34.91,31.24) ; 34.43,30.75 SW4.6 ; SW10.2 46.6,19.56 v1(49.39,19.56) ; v1(23.48,59.18) 23.36,59.06 20.56,59.06 ; v1(86.65,45.21) 87.76,44.09 CN4.4 ; SW4.1 22.27,18.1 v1(22.34,18.03) ; 84.42,42.14 v1(83.17,42.14) ; SW11.2 46.6,8.13 v1(48,8.13) ; SW4.a 17.13,33.62 v1(17.13,33.66) ; 38.74,13.84 v1(38.98,13.84)
  Top Layer w0.254: v2(75.53,11.2) 74.75,10.41 74.75,8.89 BUZZER1.2 ; SW12.2 v1(54.74,13.72) ; SW13.2 38.74,13.84
VCC: length 329.2
  Top Layer w0.15: C7.2 78.09,54.86 77.21,53.98 H6.1 H6.2 ; C7.2 80.07,55.43 R11.2 ; C7.2 78.08,55.42 C1.2 74.51,55.42 C2.2 C3.2 72.69,55.37 C4.2 ; swd.1 28.18,59.06 ; R5.2 R6.2 R7.2
  Top Layer w0.152: 43.42,30.86 39.61,30.86 37.96,32.51 37.96,35.75 38.02,35.81 38.02,36.18 37.96,36.24 37.96,37.85 37.45,38.35 25.77,38.35 25.01,39.12 10.15,39.12
  Top Layer w0.254: 81.02,45.21 80.63,45.21 v2(80,44.58) ; 81.02,45.21 L1.2 ; 81.02,45.21 H6.2 ; U1.9 51.28,35 51.22,34.94 51.22,34.42 51.28,34.36 51.28,33.51 v2(51.04,33.27) ; SW4.3 31.07,19.52 v1(33.64,22.1) 33.64,25.61 ; v2(35.93,26.29) 35.4,25.75 SW4.4 ; v1(43.8,31.24) 39.49,26.92 v2(38.98,26.92) ; 24.54,62.78 25.98,61.34 swd.1 ; 24.54,62.78 23.36,61.6 2.4G.2 ; 24.54,62.78 R5.2 ; U1.1 46.27,34.36 44.75,34.36 v2(44.57,34.54) 44.57,35.66 U1.48 ; U1.36 46.66,43.87 v2(46.34,43.56) ; SW5.4 84.06,25.87 84.06,22.48 81.49,19.9 SW5.3 77.57,16.11 v1(75.3,13.84) ; U3.3 48.51,29.06 R8.1 48.5,31.23 v1(47.49,31.23) ; v2(58.41,45.09) 63.36,45.09 v2(64.63,46.36) ; U1.24 54.28,44.14 v2(54.22,44.2) 55.11,45.09 v2(55.36,45.09) ; H5.1 10.15,39.12 28.18,57.15 28.18,59.06 30.09,57.15 oled.1 43.3,58.42 44.06,59.18 52.95,59.18 55.74,61.98 55.74,69.85 蓝牙.4 59.49,67.06 C4.2
  Bottom Layer w0.152: v1(43.8,31.24) 45.07,31.24 R2.2
  Bottom Layer w0.254: v2(38.98,26.92) 38.34,26.29 v2(35.93,26.29) ; v2(51.04,33.27) 47.95,33.27 47.93,33.29 47.93,33.41 48.02,33.5 48.02,33.94 47.71,34.25 47.27,34.25 47.18,34.16 47.06,34.16 46.77,33.86 46.77,33.43 46.61,33.27 45.84,33.27 v2(44.57,34.54) 43.8,33.78 v1(43.8,31.24) ; v1(33.64,22.1) 67.05,22.1 v1(75.3,13.84) ; v2(46.34,43.56) 46.98,44.2 v2(54.22,44.2) ; v2(55.36,45.09) v2(58.41,45.09) ; v2(80,44.58) 78.22,46.36 v2(64.63,46.36) ; R2.2 v1(47.49,31.23)
ADC_IN1: length 40
  Top Layer w0.15: U1.11 52.28,34.92 52.29,34.91 52.29,34.44 52.28,34.43 52.28,32.29 58.54,26.04 58.54,19.69 62.35,15.88 74.03,15.88 75.3,17.15 75.3,19.67 SW5.2
ADC_IN4: length 41.1
  Top Layer w0.15: U1.14 83.27,37.37 86.73,33.91 86.73,30.35 84.95,28.58 83.86,28.58 SW5.5
ADC_IN5: length 51.4
  Top Layer w0.152: v1(37.45,36.2) 37.45,24.38 30.09,17.02 25.52,17.02 24.5,18.03 24.5,19.25 SW4.2 ; U1.15 54.73,37.87 54.82,37.97 v1(56.12,37.97)
  Bottom Layer w0.152: v1(56.12,37.97) 55.36,37.21 37.96,37.21 37.45,36.7 v1(37.45,36.2)
ADC_IN6: length 37.8
  Top Layer w0.152: U1.16 54.73,38.37 54.78,38.43 55.28,38.43 55.39,38.54 56.24,38.54 56.4,38.37 56.99,38.37 v1(57.39,37.97) ; SW4.5 33.57,28.32 35.55,28.32 36.31,29.08 v1(36.31,36.58)
  Bottom Layer w0.152: v1(36.31,36.58) 36.31,37.97 37.81,39.47 55.9,39.47 v1(57.39,37.97)
BOOT0: length 5.7
  Top Layer w0.15: U1.44 45.15,38.87 45.04,38.99 v1(44.19,38.99)
  Bottom Layer w0.15: v1(44.19,38.99) 43.16,37.96 R9.2
BOOT1: length 5.3
  Top Layer w0.15: U1.20 57.51,40.37 58.16,41.02 R10.1
BUZZER: length 6.3
  Top Layer w0.15: v1(47.49,33.72) 47.78,34.01 U1.2 ; v1(44.82,32.51) 44.82,31.49 R1.1
  Bottom Layer w0.15: v1(47.49,33.72) 46.41,32.64 45.07,32.64 44.95,32.51 v1(44.82,32.51)
CE: length 46.1
  Top Layer w0.152: 18.02,59.06 18.15,58.93 18.15,54.03 18.02,53.9 18.02,53.18 v1(17.13,52.29) ; v1(50.41,47.24) 50.7,46.96 50.7,46.94 50.78,46.86 U1.29
  Bottom Layer w0.152: v1(17.13,52.29) 22.18,47.24 v1(50.41,47.24)
CSN: length 47.7
  Top Layer w0.152: 2.4G.4 19.43,60.19 19.43,58.06 19.8,57.69 v1(19.8,55.25) ; U1.25 52.78,48.81 v1(52.06,49.53)
  Bottom Layer w0.152: v1(19.8,55.25) 22.6,52.45 49.14,52.45 v1(52.06,49.53)
IRQ: length 50.5
  Top Layer w0.152: v1(9.13,55.88) 9.13,59.06 11.67,61.6 2.4G.8 ; U1.38 v1(44.44,41.87)
  Bottom Layer w0.152: v1(44.44,41.87) 23.14,41.87 v1(9.13,55.88)
KEY_1: length 36.2
  Top Layer w0.152: v1(37.33,37.59) 17.52,37.59 14.48,34.56 SW4.b ; v1(42.66,38.48) 44.83,38.48 44.92,38.4 45.23,38.4 45.31,38.48 45.67,38.48 U1.45
  Bottom Layer w0.152: v1(42.66,38.48) 41.9,38.48 41.39,38.99 38.72,38.99 v1(37.33,37.59)
KEY_2: length 27.1
  Top Layer w0.15: U1.46 43.71,37.87 43.42,37.59 v1(43.42,35.81) ; v1(61.97,32.51) 62.32,32.15 SW5.b
  Bottom Layer w0.15: v1(43.42,35.81) 43.68,35.56 58.92,35.56 v1(61.97,32.51)
KEY_DOWN: length 94.3
  Top Layer w0.152: v1(13.32,37.21) 12.31,36.2 12.31,19.3 23.87,7.75 24.12,8 SW11.1 ; v1(16.88,40.39) 17.26,40.77 21.96,40.77 v1(25.14,43.94) ; U1.32 49.28,44.32 49.34,44.38 49.34,44.92 49.28,44.98 49.28,45.35 v1(49.09,45.54)
  Bottom Layer w0.152: v1(16.88,40.39) 16.5,40.39 v1(13.32,37.21) ; v1(49.09,45.54) 26.73,45.54 v1(25.14,43.94)
KEY_LEFT: length 87.5
  Top Layer w0.152: v1(19.29,14.86) 31.09,14.86 32.11,13.84 SW13.1 ; v1(12.44,37.72) 11.17,36.45 11.17,17.02 13.32,14.86 v1(13.83,14.86) ; v1(15.74,40.77) 16.5,41.53 21.33,41.53 23.74,43.94 v1(23.99,43.94) ; U1.31 49.78,44.32 49.79,44.34 49.79,44.87 49.78,44.89 49.78,45.84 v1(49.65,45.97)
  Bottom Layer w0.152: v1(49.65,45.97) 49.33,45.97 49.2,46.1 48.7,46.1 48.57,45.97 26.02,45.97 v1(23.99,43.94) ; v1(15.74,40.77) 12.69,37.72 v1(12.44,37.72) ; v1(13.83,14.86) v1(19.29,14.86)
KEY_RIGHT: length 108.7
  Top Layer w0.152: U1.30 50.28,44.32 50.27,44.33 50.27,44.81 50.28,44.83 50.28,46.39 v1(50.04,46.63) ; v1(25.39,10.16) 41.01,10.16 44.69,13.84 48.62,13.84 48.87,13.59 ; v1(14.47,40.77) 15.74,42.04 21.07,42.04 v1(23.99,44.96) ; v1(20.18,10.29) 17.39,10.29 11.04,16.64 11.04,16.79 10.91,16.91 10.91,36.55 11.04,36.68 v1(11.04,37.34)
  Bottom Layer w0.152: v1(20.18,10.29) 25.26,10.29 v1(25.39,10.16) ; v1(23.99,44.96) 25.66,46.63 v1(50.04,46.63) ; v1(14.47,40.77) v1(11.04,37.34)
KEY_UP: length 86.4
  Top Layer w0.152: U1.33 v1(48.78,44.93) ; SW10.1 41.77,19.43 38.29,15.95 21.42,15.95 13.15,24.22 13.15,25.32 13.58,25.75 13.58,30.8 13.15,31.22 13.15,32.56 13.58,32.98 v1(13.58,36.07) ; v1(25.26,42.93) 22.47,40.13 v1(17.64,40.13)
  Bottom Layer w0.152: v1(17.64,40.13) v1(13.58,36.07) ; v1(25.26,42.93) 27.26,44.93 v1(48.78,44.93)
MCU_RX: length 69.1
  Top Layer w0.152: v1(64.76,65.41) 64.76,73.41 蓝牙.2 ; v1(59.55,38.1) 66.16,38.1 67.68,39.62 84.4,39.62 84.42,39.64 ; v1(58.41,36.83) 58.37,36.87 55.22,36.87 55.21,36.86 54.74,36.86 54.73,36.87 U1.13
  Bottom Layer w0.152: v1(58.41,36.83) 59.55,37.97 v1(59.55,38.1) 59.55,60.2 v1(64.76,65.41)
MCU_TX: length 72.2
  Top Layer w0.152: v1(63.36,38.74) 65.52,40.89 84.42,40.89 ; 蓝牙.1 67.11,65.47 v1(67.17,65.41) ; v1(63.49,36.83) 61.71,35.05 53.1,35.05 U1.12
  Bottom Layer w0.152: 63.36,38.68 63.36,36.96 v1(63.49,36.83) ; 63.36,38.68 63.38,38.66 63.38,38.71 v1(63.36,38.74) 63.36,38.68 ; 63.36,38.68 63.31,38.74 63.31,61.54 v1(67.17,65.41)
MISO: length 48.8
  Top Layer w0.152: v1(51.68,48.13) 51.78,48.03 51.78,47.46 51.79,47.46 51.79,46.99 51.78,46.98 U1.27 ; v1(16.88,54.1) 15.86,54.1 12.94,57.02 12.94,59.06
  Bottom Layer w0.152: v1(51.68,48.13) 48.12,51.69 21.83,51.69 19.42,54.1 v1(16.88,54.1)
MOSI: length 49
  Top Layer w0.152: v1(17.4,53.23) 17.4,56.23 17.49,56.32 17.49,56.71 16.78,57.42 16.78,58.36 16.79,58.37 16.79,60.29 2.4G.6 ; v1(51.17,47.37) 51.28,47.26 51.28,46.71 51.29,46.69 51.29,44.33 51.28,44.32 U1.28
  Bottom Layer w0.152: v1(51.17,47.37) 47.23,51.31 21.71,51.31 19.78,53.23 v1(17.4,53.23)
OLED_SCL: length 22.5
  Top Layer w0.15: 45.84,57.15 56.38,46.61 56.38,41.28 56.11,41.01 54.42,41.01 U1.21
OLED_SDA: length 21.3
  Top Layer w0.15: v1(54.71,47.22) 56,45.93 56,41.78 55.59,41.37 U1.22 ; v1(55.74,48.51) 48.38,55.88 oled.3
  Bottom Layer w0.15: v1(54.71,47.22) 55.74,48.26 v1(55.74,48.51)
OSC_IN: length 35.2
  Top Layer w0.15: 33.76,43.69 34.78,42.67 38.98,42.67 39.99,43.69 42,43.69 42.92,42.78 42.92,40.01 42.03,39.12 42.03,36 41.46,35.43 41.46,34.99 43.2,33.24 48.48,33.24 49.01,33.77 49.01,34.04 49.28,34.3 49.28,34.43 49.27,34.44 49.27,34.91 49.28,34.92 U1.5
  Top Layer w0.254: X1.1 32.42,46.59 C9.1 33.45,44.83 33.52,44.83 33.7,44.65 33.7,43.75 33.76,43.69
OSC_OUT: length 43.2
  Top Layer w0.15: 40.88,42.55 42.15,41.28 42.15,39.75 41.77,39.37 39.36,39.37 38.47,38.48 38.47,32.39 38.85,32 40.19,32 41.17,32.99 48.85,32.99 49.53,33.67 49.53,34.05 49.78,34.29 U1.6
  Top Layer w0.254: X1.3 35.94,50.79 36.12,50.61 36.12,48.57 36.24,48.46 36.3,48.46 36.64,48.12 36.64,48.06 37.07,47.63 37.07,47.37 36.89,47.19 C10.1 36.89,46.17 35.17,44.45 35.17,43.79 R13.1 35.4,43.82 v2(38.6,43.82)
  Bottom Layer w0.254: v2(40.88,42.67) 39.74,43.82 v2(38.6,43.82)
RESET: length 12.1
  Top Layer w0.15: U1.7 50.28,34.92 50.29,34.91 50.29,34.44 50.03,34.18 50.03,33.81 50.03,33.81 50.03,31.25 R8.2 53.08,28.18 53.08,24.64
SCK: length 47.7
  Top Layer w0.152: U1.26 52.28,47.75 52.29,47.77 52.29,48.21 52.28,48.22 52.28,48.39 51.93,48.73 v1(51.93,48.79) ; v1(16.37,54.86) 15.48,55.75 15.48,59.06
  Bottom Layer w0.152: v1(51.93,48.79) 51.82,48.79 48.54,52.07 21.96,52.07 19.67,54.36 19.52,54.36 19.01,54.86 v1(16.37,54.86)
SWDCLK: length 57.5
  Top Layer w0.152: U1.37 45.78,51.85 42.13,55.5 38.47,55.5 37.45,56.52 v1(32.88,56.52) ; v1(24.12,58.17) 17.77,51.82 H5.6 ; swd.3 33.39,61.21 33.39,59.44 31.99,58.04 v1(31.49,58.04)
  Bottom Layer w0.152: v1(24.12,58.17) 31.45,58.17 31.53,58.09 v1(31.49,58.04) 32.88,56.64 v1(32.88,56.52)
SWDIO: length 62.9
  Top Layer w0.152: v1(30.72,59.18) swd.2 ; U1.34 48.14,44.01 48.14,50.91 v1(44.19,54.86) ; H5.5 16.63,49.28 v1(23.61,56.26)
  Bottom Layer w0.152: v1(23.61,56.26) 23.87,56.01 33.42,56.01 35.44,58.03 ; v1(30.72,59.18) 34.29,59.18 35.44,58.03 ; v1(44.19,54.86) 43.93,55.12 42.03,55.12 41.01,56.13 41.01,58.04 v1(38.09,58.04) 38.08,58.03 35.44,58.03
USART1_RX: length 54.4
  Top Layer w0.152: H5.4 3.82,42.95 CN6.3 ; U1.43 45.39,39.37 45.29,39.47 44.34,39.47 43.68,40.13 v1(43.68,41.15)
  Bottom Layer w0.152: H5.4 16.88,46.74 22.47,41.15 v1(43.68,41.15)
USART1_TX: length 49.7
  Top Layer w0.152: U1.42 44.7,39.87 v1(44.31,40.26) ; CN6.2 5.07,41.66 5.35,41.94 5.35,41.98 5.63,42.26 5.67,42.26 H5.3
  Bottom Layer w0.152: H5.3 18.53,44.2 22.72,40.01 44.06,40.01 v1(44.31,40.26)
USB_D+: length 57.5
  Top Layer w0.152: type-c.B6 30.87,67.69 30.87,65.39 31.36,64.9 32.25,64.9 ; v1(53.96,58.55) 57.39,55.12 v1(57.39,41.4) ; type-c.A6 31.99,65.16 32.25,64.9 ; 32.25,64.9 v1(33.26,64.9) ; v1(52.44,59.94) 46.09,59.94 45.09,60.94 USB.3 43.27,60.2 v1(43.17,60.2) ; U1.17 54.73,38.87 54.74,38.86 55.22,38.86 55.23,38.87 56.64,38.87 v1(57.52,39.75)
  Bottom Layer w0.152: v1(33.26,64.9) 36.52,64.9 41.19,60.23 42,60.23 42.03,60.2 v1(43.17,60.2) ; v1(53.96,58.55) 52.57,59.94 v1(52.44,59.94) ; v1(57.39,41.4) 57.52,41.28 v1(57.52,39.75)
USB_D-: length 55.3
  Top Layer w0.152: v1(32.5,65.66) 32.5,66.84 32.52,66.86 32.52,67.32 32.5,67.34 32.5,67.8 type-c.B7 ; v1(31.49,65.79) 31.49,66.83 31.46,66.86 31.46,67.32 31.49,67.34 31.49,67.81 type-c.A7 ; v1(49.77,60.71) 49.3,60.71 49.29,60.7 49.17,60.7 49.08,60.61 48.5,60.61 USB.2 47.09,60.82 v1(46.73,60.45) ; v1(56.38,39.75) 56,39.37 U1.18
  Bottom Layer w0.152: v1(46.73,60.45) 45.71,59.44 40.25,59.44 36.41,63.28 36.41,63.32 35.39,64.33 33.27,64.33 33.22,64.39 32.61,64.39 ; 32.61,64.39 31.87,64.39 31.49,64.77 v1(31.49,65.79) ; 32.61,64.39 32.61,65.55 v1(32.5,65.66) ; 49.77,60.58 52.12,58.23 52.12,56.73 53.08,55.78 53.08,52.71 53.96,51.82 53.96,45.2 56.38,42.79 v1(56.38,39.75)
WKUP: length 10.5
  Top Layer w0.15: U1.10 51.78,31.91 55.74,27.94 55.74,26.55
$1N1068: length 30.4
  Top Layer w0.15: U3.2 46.74,22.84 47.74,21.84 54.09,21.84 65.4,10.53 BUZZER1.1
$1N1070: length 4.5
  Top Layer w0.15: U3.1 46.69,29.73 R1.2 v1(43.68,29.73)
  Bottom Layer w0.15: v1(43.68,29.73) R1.2
$1N1843: length 2.5
  Top Layer w0.15: R5.1 22.9,64.26 LED3.2
$1N1848: length 2.5
  Top Layer w0.15: LED2.2 23,65.91 R6.1
$1N1853: length 2.5
  Top Layer w0.15: LED1.2 22.91,67.59 R7.1
$1N7181: length 41.9
  Top Layer w0.15: v1(74.67,44.96) H6.4
  Bottom Layer w0.15: v1(74.67,44.96) 66,36.29 40.67,36.29 R9.1
$1N7183: length 22.4
  Top Layer w0.15: H6.3 74.54,51.69 74.54,53.21 74.16,53.59 70.73,53.59 70.22,53.09 70.22,50.43 R10.2
$1N9291: length 5.4
  Top Layer w0.15: R11.1 R12.2 81.77,51.68 81.46,51.37 81.46,49.94
$1N9393: length 2.2
  Top Layer w0.15: U18.3 83.36,45.46 L1.1
$1N10654: length 13.2
  Top Layer w0.254: C9.2 35.46,46.23 C10.2 35.8,46.51 35.8,47.37 36.06,47.63 v2(36.06,47.88) ; X1.4 31.98,50.79 v2(30.22,49.02)
  Bottom Layer w0.254: v2(30.22,49.02) 31.36,47.88 v2(36.06,47.88)

## Copper pours and planes (outline as drawn; the poured copper is in the pictures)
GND on Top Layer: 0.12,76.45 90.41,76.45 90.41,-0.13 0.12,-0.13
GND on Bottom Layer: -0.52,75.44 90.67,75.44 90.67,-0.13 -0.52,-0.13

Small or netless copper shapes (teardrops, artwork), in the pictures only: 343 on Top Layer, 108 on Bottom Layer
